# Altium schematic sheet GR_Pi.SchDoc
size A4
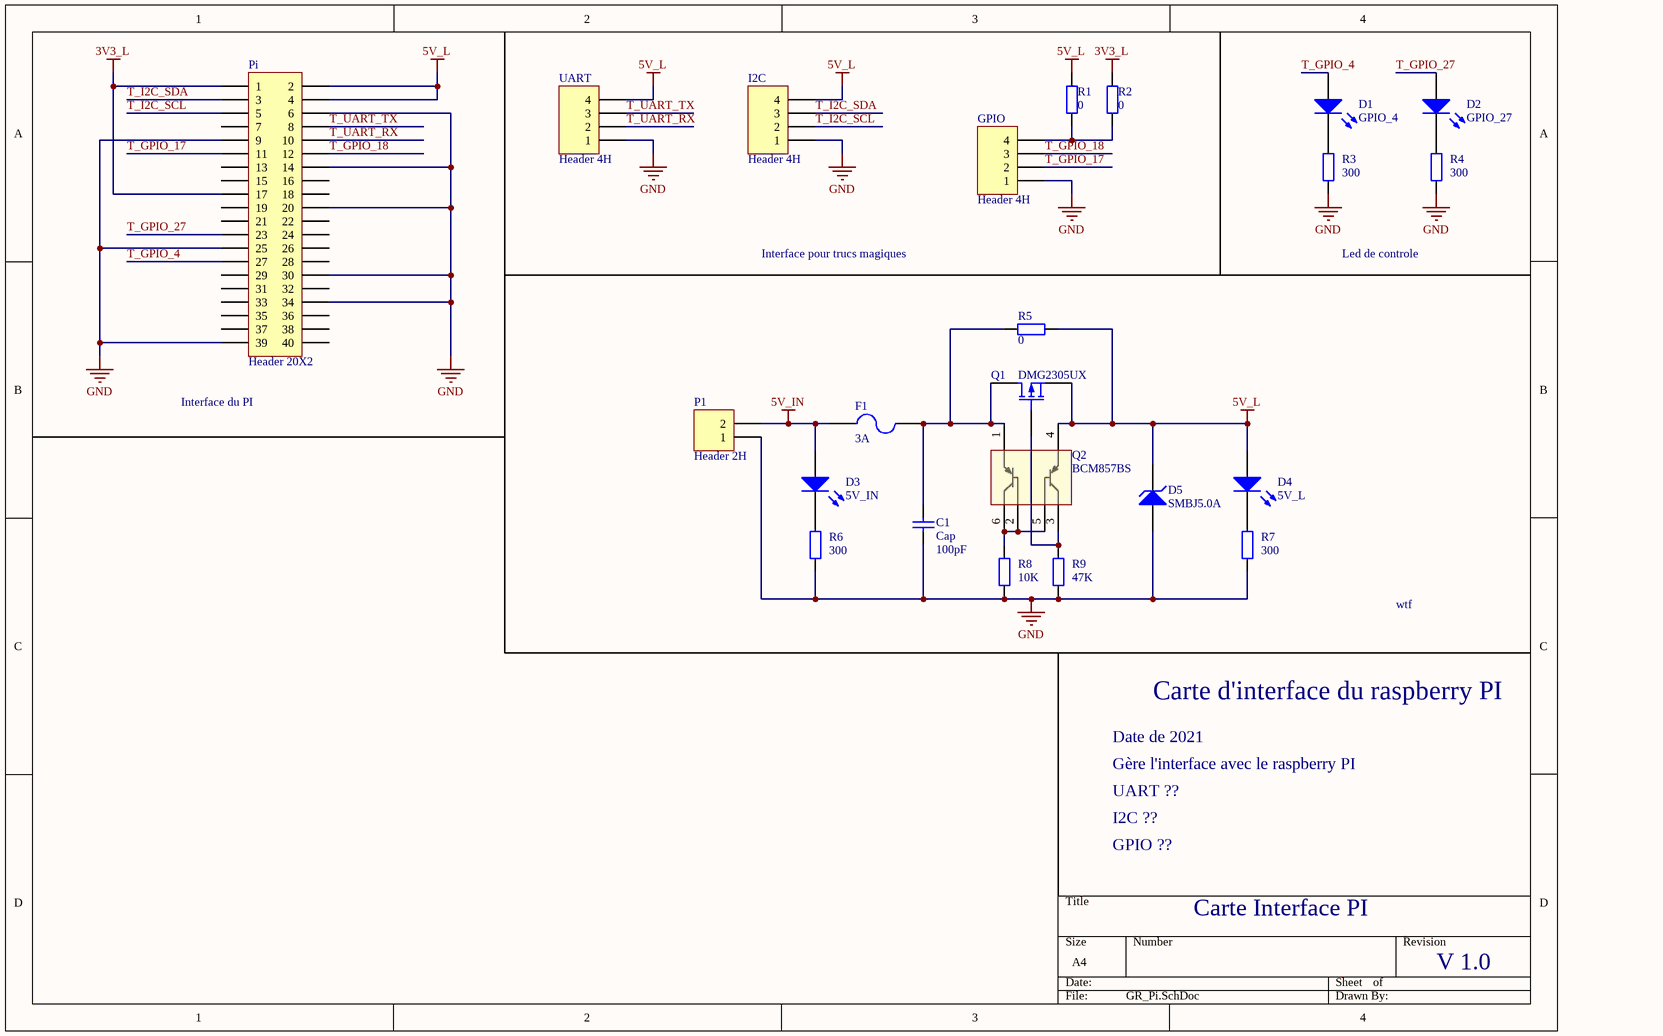
[diagram p0: GR_Pi.SchDoc]

## Parts
C1  Cap  value 100pF  [Capacitor 1206]
D1  GPIO_4  [KP-3216SEC]
D2  GPIO_27  [KP-3216SEC]
D3  5V_IN  [KP-3216SEC]
D4  5V_L  [KP-3216SEC]
D5  SMBJ5.0A  [SMB]
F1  3A  [Resistor 1206]
GPIO  Header 4H  [S4B-XH-A]
I2C  Header 4H  [S4B-XH-A]
P1  Header 2H  [Molex_MiniFitJr_2x1H]
Pi  Header 20X2  [HDR2X20]
Q1  DMG2305UX  [SOT23_L]
Q2  BCM857BS  [SOT65P210X110-6N]
R1  value 0  [Resistor 1206]  (hidden comment: Res2)
R2  value 0  [Resistor 1206]  (hidden comment: Res2)
R3  value 300  [Resistor 1206]  (hidden comment: Res2)
R4  value 300  [Resistor 1206]  (hidden comment: Res2)
R5  value 0  [Resistor 1206]  (hidden comment: Res2)
R6  value 300  [Resistor 1206]  (hidden comment: Res2)
R7  value 300  [Resistor 1206]  (hidden comment: Res2)
R8  value 10K  [Resistor 1206]  (hidden comment: Res2)
R9  value 47K  [Resistor 1206]  (hidden comment: Res2)
UART  Header 4H  [S4B-XH-A]

## Nets
3V3_L: Pi.1 Pi.17 R2.1
5V_IN: D3.1(A) F1.1 P1.2
5V_L: D4.1(A) D5.2(K) I2C.4 Pi.2 Pi.4 Q1.3(S) Q2.4(EMITTER_TR2) R1.1 R5.1 UART.4
GND: C1.1 D5.1(A) GPIO.1 I2C.1 P1.1 Pi.6 Pi.9 Pi.14 Pi.20 Pi.25 Pi.30 Pi.34 Pi.39 R3.1 R4.1 R6.1 R7.1 R8.1 R9.1 UART.1
T_GPIO_4: D1.1(A) Pi.27
T_GPIO_17: GPIO.2 Pi.11
T_GPIO_18: GPIO.3 Pi.12
T_GPIO_27: D2.1(A) Pi.23
T_I2C_SCL: I2C.2 Pi.5
T_I2C_SDA: I2C.3 Pi.3
T_UART_RX: Pi.10 UART.2
T_UART_TX: Pi.8 UART.3
NetC1_2: C1.2 F1.2 Q1.1(D) Q2.1(EMITTER_TR1) R5.2
NetD1_2: D1.2(K) R3.2
NetD2_2: D2.2(K) R4.2
NetD3_2: D3.2(K) R6.2
NetD4_2: D4.2(K) R7.2
NetGPIO_4: GPIO.4 R1.2 R2.2
NetQ1_2: Q1.2(G) Q2.3(COLLECTOR_TR2) R9.2
NetQ2_2: Q2.2(BASE_TR1) Q2.5(BASE_TR2) Q2.6(COLLECTOR_TR1) R8.2

Not connected (* = marked no-connect by the designer): Pi 7 13 15 16 18 19 21 22 24 26 28 29 31 32 33 35 36 37 38 40

## Notes on the sheet
- Interface pour trucs magiques
- Led de controle
- Interface du PI
- wtf
- Carte d'interface du raspberry PI
- Date de 2021
- Gère l'interface avec le raspberry PI
- UART ??
- I2C ??
- GPIO ??
- Carte Interface PI
- V 1.0

## Library data of the parts
C1 = Cap: Capacitor; Published: 8-Jun-2000; LatestRevisionDate: 17-Jul-2002; LatestRevisionNote: Re-released for DXP Platform.; PackageReference: RAD-0.3; Publisher: Altium Limited; PackageDescription: Radial Cap, Thru-Hole; 2 Leads; 0.3 in Pin Spacing
D1-D4 = LED2: Typical RED, GREEN, YELLOW, AMBER GaAs LED; Published: 8-Jun-2000; LatestRevisionDate: 17-Jul-2002; LatestRevisionNote: Re-released for DXP Platform.; PackageVersion: Feb-2002; PackageReference: 3.2X1.6X1.1; Publisher: Altium Limited; PackageDescription: SM LED; 2 Flat Leads
D5 = D Zener: Zener Diode; Published: 8-Jun-2000; LatestRevisionDate: 17-Jul-2002; LatestRevisionNote: Re-released for DXP Platform.; PackageReference: DIODE-0.7; Publisher: Altium Limited; PackageDescription: Diode, Thru-Hole; 2 Leads; 0.7 in Pin Spacing
F1 = Fuse 2: Fuse; Published: 8-Jun-2000; LatestRevisionDate: 17-Jul-2002; LatestRevisionNote: Re-released for DXP Platform.; PackageReference: PIN-W2/E2.8; Publisher: Altium Limited; PackageDescription: Thru-Hole; 2 Leads
GPIO I2C UART = Header 4H: Header, 4-Pin, Right Angle; LatestRevisionDate: 17-Jul-2002; LatestRevisionNote: Re-released for DXP Platform.; Publisher: Altium Limited
P1 = Header 2H: Header, 2-Pin, Right Angle; LatestRevisionDate: 17-Jul-2002; LatestRevisionNote: Re-released for DXP Platform.; Publisher: Altium Limited
Pi = Header 20X2: Header, 20-Pin, Dual row; LatestRevisionDate: 17-Jul-2002; LatestRevisionNote: Re-released for DXP Platform.; Publisher: Altium Limited
Q1 = MOSFET-P: P-Channel MOSFET; Published: 8-Jun-2000; LatestRevisionDate: 17-Jul-2002; LatestRevisionNote: Re-released for DXP Platform.; PackageVersion: 1995/1996; PackageReference: E3; Publisher: Altium Limited; PackageDescription: TO, Flat Index; 3 In-Line, Axial Leads; Body Dia. 4.6mm; Lead Dia. 0.5 mm (max)
Q2 = BCM857BS: Transistor; Manufacturer_Name: Nexperia; Datasheet Link: https://assets.nexperia.com/documents/data-sheet/BCM857BV_BS_DS.pdf; Height: 1.1mm; Manufacturer_Part_Number: BCM857BS; Mouser Part Number: N/A; Mouser Price/Stock: https://www.mouser.com/Search/Refine.aspx?Keyword=N%2FA
R1-R9 = Res2: Resistor; Published: 8-Jun-2000; LatestRevisionDate: 17-Jul-2002; LatestRevisionNote: Re-released for DXP Platform.; PackageReference: AXIAL-0.4; Publisher: Altium Limited; PackageDescription: Axial Device, Thru-Hole; 2 Leads; 0.4 in Pin Spacing